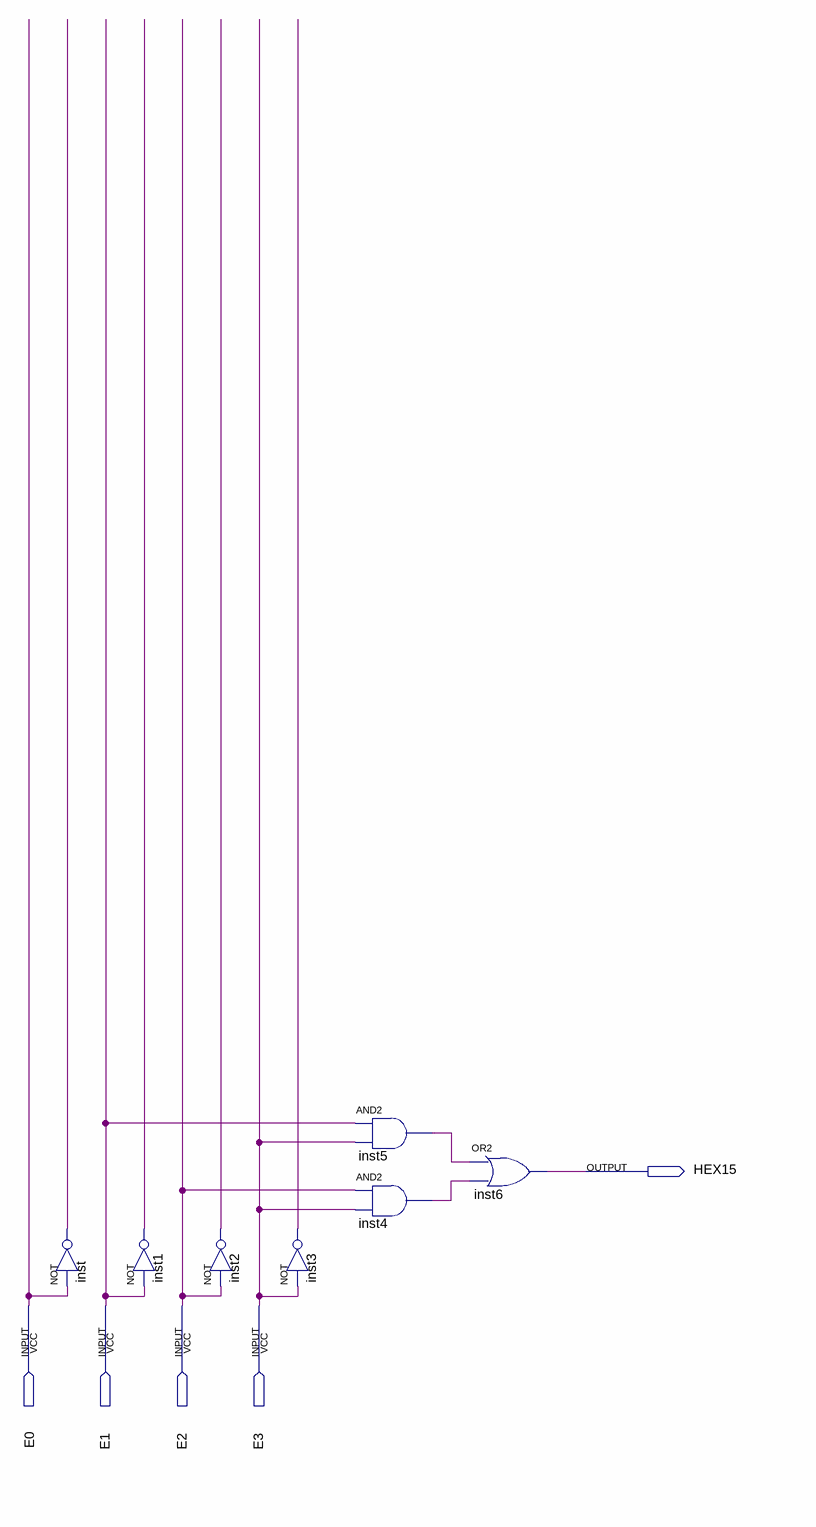
[diagram p0: schematic sheet]
// Quartus schematic HEX_15_4BITS.bdf as structural Verilog: 7 symbols, 5 pins
module HEX_15_4BITS (
  input  E0,
  input  E1,
  input  E2,
  input  E3,
  output HEX15
);

  wire inst1_out, inst2_out, inst3_out, inst4_out, inst5_out, inst_out;

  not inst (inst_out, E0);
  not inst1 (inst1_out, E1);
  not inst2 (inst2_out, E2);
  not inst3 (inst3_out, E3);
  and inst5 (inst5_out, E1, E3);
  and inst4 (inst4_out, E2, E3);
  or inst6 (HEX15, inst5_out, inst4_out);
endmodule
